# Altium schematic sheet Micro_USB_&_USB-UART.SchDoc
size 431 x 279 mm; Organization: ORGANIZATION; Address1: ADDRESS 1; Address2: ADDRESS 2; Address3: ADDRESS 3; Address4: ADDRESS 4; Revision: -; SheetNumber: 2; SheetTotal: 4; ENG_APP_DATE: --/--/--; DSN_APP_DATE: --/--/--; CHK_APP_DATE: --/--/--
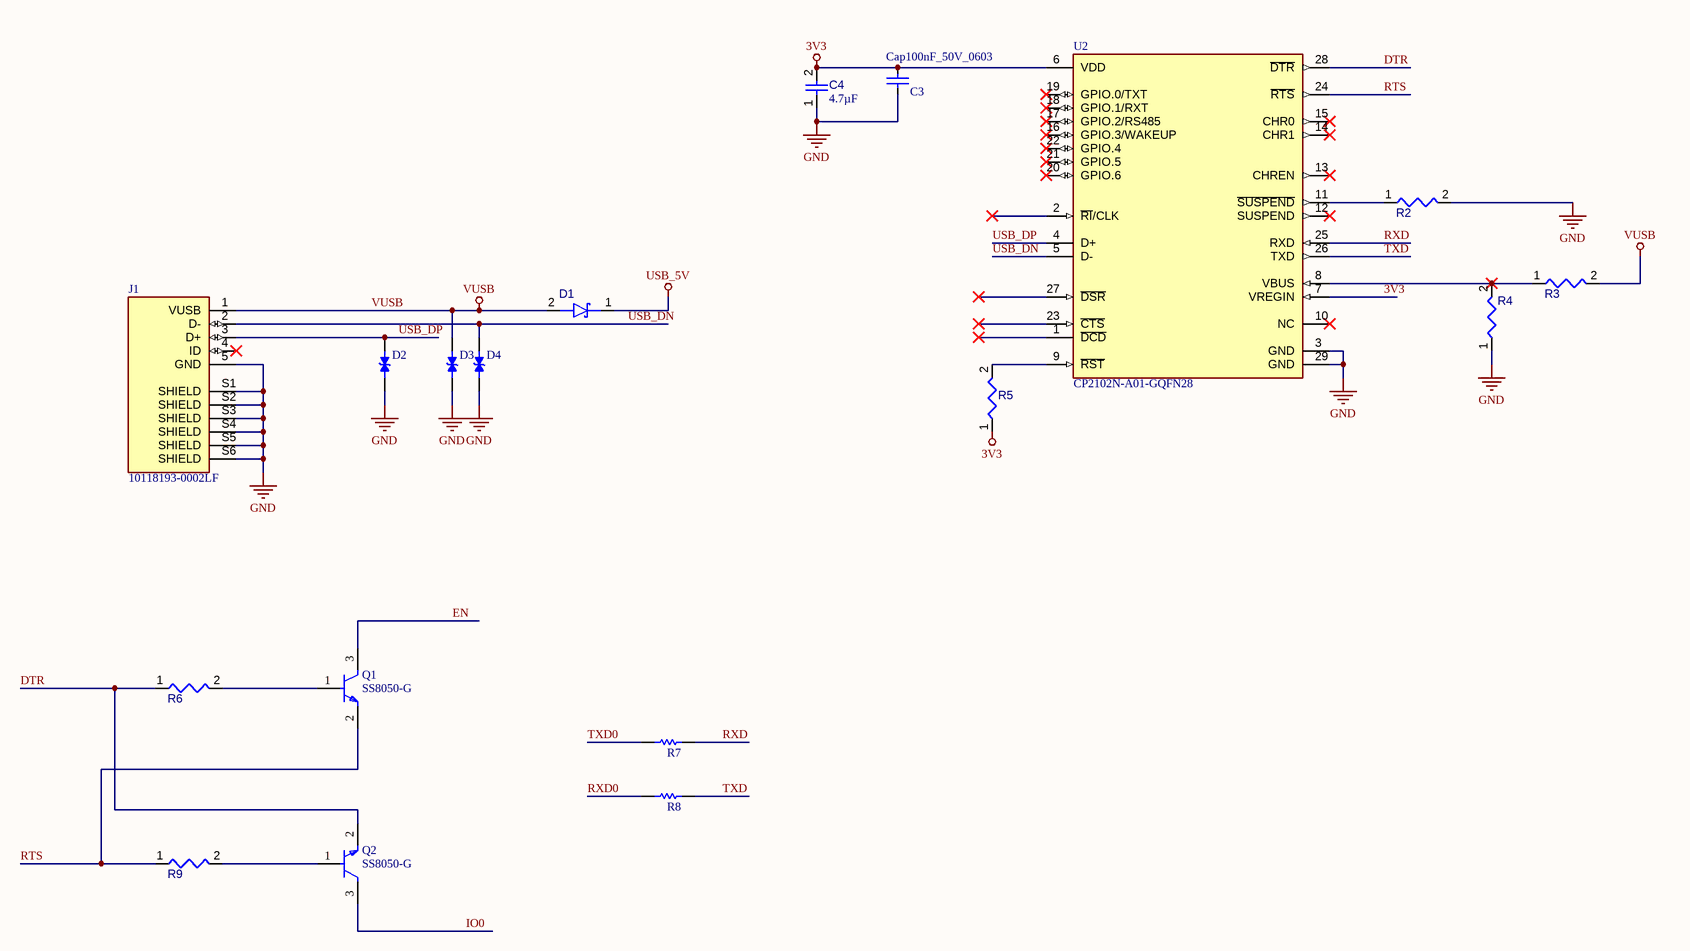
[diagram p0: Micro_USB_&_USB-UART.SchDoc]

## Parts
C3  Cap100nF_50V_0603  [0603C_L]
C4  value 4.7µF  [CAPC0805(2012)145_L]  (hidden comment: Capacitor 4.7µF +/-40% 25V 0805)
D1  RB520CM-30  [ROHM-VMN2-2_V]  (value not drawn)
D2  LESD5D5.0CT1G  [TVS_LESD5D5.0CT1G]  (value not drawn)
D3  LESD5D5.0CT1G  [TVS_LESD5D5.0CT1G]  (value not drawn)
D4  LESD5D5.0CT1G  [TVS_LESD5D5.0CT1G]  (value not drawn)
J1  10118193-0002LF  [AMPHENOL_10118193-0002LF]
Q1  SS8050-G  [FP-SS8050-G-MFG]
Q2  SS8050-G  [FP-SS8050-G-MFG]
R2  Resistor 10K  +/-1 % 0402 63 mW  [RESC0402(1005)_L]  (value not drawn)
R3  MFR-25FBF52-22K1  [RESA60-630X240]  (value not drawn)
R4  Resistor 47K5 +/-1 % 0402 63 mW  [RESC0402(1005)_L]  (value not drawn)
R5  Resistor 2K +/-5 % 0402 63 mW  [RESC0402(1005)_L]  (value not drawn)
R6  Resistor 10K  +/-1 % 0402 63 mW  [RESC0402(1005)_L]  (value not drawn)
R7  Resistor 0R +/- 5% 1206 250 mW  [RESC3216X60X45ML15T20]  (value not drawn)
R8  Resistor 0R +/- 5% 1206 250 mW  [RESC3216X60X45ML15T20]  (value not drawn)
R9  Resistor 10k +/-1% 0805 125 mW  [RESC2013X50X35ML15T15]  (value not drawn)
U2  CP2102N-A01-GQFN28  [FP-CP2102N-A01-GQFN28-MFG]

## Nets
3V3: C3.1 C4.2 R5.1 U2.6(VDD) U2.7(VREGIN)
GND: C3.2 C4.1 D2.1 D3.1 D4.1 J1.5(GND) J1.S1(SHIELD) J1.S2(SHIELD) J1.S3(SHIELD) J1.S4(SHIELD) J1.S5(SHIELD) J1.S6(SHIELD) R2.2 R4.1 U2.3(GND) U2.29(GND)
USB_5V: D1.1(K)
VUSB: D1.2(A) D3.2 J1.1(VUSB) R3.2
DTR: Q2.2(E) R6.1 U2.28(~{DTR})
EN: Q1.3(C)
IO0: Q2.3(C)
RTS: Q1.2(E) R9.1 U2.24(~{RTS})
RXD: R7.2 U2.25(RXD)
RXD0: R8.1
TXD: R8.2 U2.26(TXD)
TXD0: R7.1
USB_DN: D4.2 J1.2(D-) U2.5(D-)
USB_DP: D2.2 J1.3(D+) U2.4(D+)
NetQ1_1: Q1.1(B) R6.2
NetQ2_1: Q2.1(B) R9.2
NetR2_1: R2.1 U2.11(~{SUSPEND})
NetR3_1: R3.1 R4.2 U2.8(VBUS)
NetR5_2: R5.2 U2.9(~{RST})

Not connected (* = marked no-connect by the designer): J1 4(ID)*; U2 1(~{DCD})* 2(~{RI}/CLK)* 10(NC)* 12(SUSPEND)* 13(CHREN)* 14(CHR1)* 15(CHR0)* 16(GPIO.3/WAKEUP)* 17(GPIO.2/RS485)* 18(GPIO.1/RXT)* 19(GPIO.0/TXT)* 20(GPIO.6)* 21(GPIO.5)* 22(GPIO.4)* 23(~{CTS})* 27(~{DSR})*

## Notes on the sheet
- DWG. NO.
- REV.
- SHT.
- THIS DOCUMENT AND THE DATA DISCLOSED HEREIN OR HEREWITH IS THE PROPERTY OF ALTIUM LIMITED AND MAY BE FREELY DISTRIBUTED IN WHOLE. NO RIGHTS ARE RESERVED OR EXPRESS OR IMPLIED WARANTEE GIVEN.
- REVISION
- DESCRIPTION
- DATE
- APPROVED
- ENG:
- DSN:
- APPROVALS
- PROJECT REVISION:
- www.altium.com <http://www.altium.com>
- DOCUMENT REVISION:
- 92037, La Jolla
- USA
- Altium Ltd.
- 4225 Executive Square
- CHK:
- REFERENCE DOCUMENTS
- DESIGN ITEM:
- TITLE
- VARIANT
- BOM:
- FAB DWG:
- PCB DWG:
- ASSY DWG:
- SCALE:
- SIZE
- B
- CAGE CODE
- FILE NAME
- DWG NO.
- SHEET
- OF
- REV

## Library data of the parts
C3 = CMP-001-00084-1: Ceramic Capacitor, Multilayer, Ceramic, 50V, 80% +Tol, 20% -Tol, Y5V, -82/+22% TC, 0.1uF, Surface Mount, 0603; Manufacturer: Yageo; Manufacturer Part Number: CC0603ZRY5V9BB104; Value: 100nF; Multilayer: Yes; Mounting Technology: Surface Mount; Case/Package: 0603; Pins: 2; RoHS Compliant: Yes; Min Operating Temperature: -30°C; Max Operating Temperature: 85°C; Capacitor Type: Ceramic; Voltage Rating: 50V; Component Type: Capacitors; Source: WCT.SCHLIB; Design Item ID: Cap100nF_50V_0603; Tolerance (fill in as +-): 80%; Packaging: Tape and Reel; Termination: Wraparound; Height: 0.8mm; Reach SVHC Compliant: Yes; Rated DC Voltage (URdc): 50V; Package Style: SMTMeter; Tolerance  (fill in as +-): 20%; Length: 1.6mm; JESD-609 Code: e3; Terminal Finish: Nickel; Dielectric Material: Ceramic; Temperature Characteristics Code: Y5V; Package Shape: Rectangular; Width: 0.8mm
C4 = CMP-001-00080-4: Chip Capacitor, 4.7µF +/-40%, 25V, 0805, Thickness 1.45 mm; Tolerance: 20%; Voltage Rating: 25V; Min Operating Temperature: -55°C; Max Operating Temperature: 85°C; Pins: 2; Mounting Technology: SMT; Case/Package: 0805
D1 = CMP-004-00028-3: DIODE SCHOTTKY 30V 100MA VMN2M; Case/Package: SMD/SMT; Pins: 2; Mounting Technology: SMT
D2-D4 = LESD5D5.0CT1G: Transient Voltage Suppressors for ESD Protection; MF: Leshan Radio Co.; Check_prices: https://www.snapeda.com/parts/LESD5D5.0CT1G/Leshan+Radio+Co./view-part/?ref=eda; Value: *; Availability: Not in stock; Package: None; SnapEDA_Link: https://www.snapeda.com/parts/LESD5D5.0CT1G/Leshan+Radio+Co./view-part/?ref=snap; MP: LESD5D5.0CT1G; Price: None
J1 = 10118193-0002LF: Micro USB 2.0, Input Output Connectors, B TYPE RECEPTACLE with flange; MF: Amphenol ICC (FCI); SnapEDA_Link: https://www.snapeda.com/parts/10118193-0002LF/Amphenol+FCI/view-part/?ref=snap; Package: None; Value: *; MP: 10118193-0002LF; Check_prices: https://www.snapeda.com/parts/10118193-0002LF/Amphenol+FCI/view-part/?ref=eda
Q1 Q2 = CMP-20235-000001-1: NPN TRANSISTOR 1.5A 40V SOT-23 R; Transition Frequency: 100MHz; Max Breakdown Voltage: 25V; Collector Emitter Voltage (VCEO): 400mV; Max Power Dissipation: 300mW; Max Collector Current: 1.5A; Case/Package: TO-236-3; Packaging: Tape and Reel; RoHS Compliant: Yes; Mount: Surface Mount; Collector Emitter Breakdown Voltage: 25V
R2 = CMP-009-00149-3: Chip Resistor, 10 kOhms, +/-1 %, 63 mW, -55 to 125 degC, 0402; Tolerance: 1%; Power: 63mW; Case/Package: 0402; Pins: 2; Min Operating Temperature: -55°C; Max Operating Temperature: 155°C; Value: 10k
R3 = CMP-009-00052-4: Axial Resistor, 22.1 KOhm, +/- 1%, 0.25 W, -55 to 155 degC, 2-Pin THD, RoHS, Bulk; Manufacturer: Yageo; Power: 250mW; Voltage Rating: 250V; Value: 22.1k; Mounting Technology: TH; Case/Package: Axial; RoHS Compliant: True; Min Operating Temperature: -55°C; Max Operating Temperature: 155°C; Tolerance: 1%; Packaging: Bulk; Package Quantity: 200; Package Reference: MFR-25; Manufacturer URL: http://www.yageo.com/; Package Description: 2-Pin Axial Lead, Dia 2.4 mm, Body Length 6.3 mm; Datasheet Version: Apr-13; Datasheet URL: http://www.yageo.com/documents/recent/Yageo%20LR_MFR_2013.pdf
R4 = CMP-009-00137-3: Chip Resistor, 47,5 kOhms, +/-1 %, 63 mW, -55 to 155 degC, 0402; Tolerance: 1%; Power: 63mW; Value: 47.5k; Case/Package: 0402; Pins: 2; Min Operating Temperature: -55°C; Max Operating Temperature: 155°C
R5 = CMP-009-00138-3: Chip Resistor, 2 kOhms, +/-5 %, 63 mW, -55 to 155 degC, 0402; Tolerance: 5%; Power: 63mW; Case/Package: 0402; Pins: 2; Min Operating Temperature: -55°C; Max Operating Temperature: 155°C; Value: 2k
R6 = CMP-009-00149-3: Chip Resistor, 10 kOhms, +/-5 %, 63 mW, -55 to 125 degC, 0402; Tolerance: 1%; Power: 63mW; Case/Package: 0402; Pins: 2; Min Operating Temperature: -55°C; Max Operating Temperature: 155°C; Value: 10k
R7 R8 = CMP-009-00002-5: Chip Resistor, 0 Ohm, +/- 5%, 0.25 W, -55 to 155 degC, 1206 (3216 Metric); Power: 250mW; Voltage Rating: 200V; Value: 0; Mounting Technology: SM; Case/Package: 1206; Pins: 2; RoHS Compliant: True; Min Operating Temperature: -55°C; Max Operating Temperature: 155°C; Tolerance: 5%
R9 = CMP-009-00018-5: Chip Resistor, 10 KOhm, +/- 5%, 125 mW, -55 to 155 degC, 0805 (2012 Metric); Tolerance: 1%; Power: 125mW; Voltage Rating: 150V; Mounting Technology: SM; Case/Package: 0805; Pins: 2; RoHS Compliant: True; Min Operating Temperature: -55°C; Max Operating Temperature: 155°C; Value: 10k
U2 = CMP-08093-000004-1: IC BRIDGE USB TO UART 28QFN; Manufacturer: Silicon Labs; Standoff Height: 0mm; Max Junction Temp: +105°C; Usb Standard: USB 2.0; Number Of Ports: 1; Nominal Supply Current: 195-13700uA; Min Supply Voltage: 1.71V; Max Supply Voltage: 5.25V; Interface: UART,USB,RS-232,RS-485; Height: 0.8mm; Package: CP2102N-A01-GQFN28; Temperature Range Low: -40°C; Lead Free: Yes; Category: IC; Ambient Temperature Range High: +85°C; Device Class L3: USB Interface ICs; Octopart: https://octopart.com/cp2102n-a01-gqfn28-silicon+labs-74636024; Manufacturer Part Number: CP2102N-A01-GQFN28; Device Class L2: Interface ICs; ComponentLink2URL: https://media.digikey.com/pdf/Data%20Sheets/Silicon%20Laboratories%20PDFs/CP2102N_Rev.1.3_DS.pdf; Automotive: No; Temperature: -40°C to +85°C; Device Class L1: Integrated Circuits (ICs); Mouser Description: IC BRIDGE USB TO UART 28QFN; RoHS: TRUE; Ambient Temperature Range Low: -40°C; Temperature Range High: +85°C; Ipc Land Pattern Name: QFN50P500X500X75-28; Digikey Description: IC BRIDGE USB TO UART 28QFN; ComponentLink2Description: Datasheet